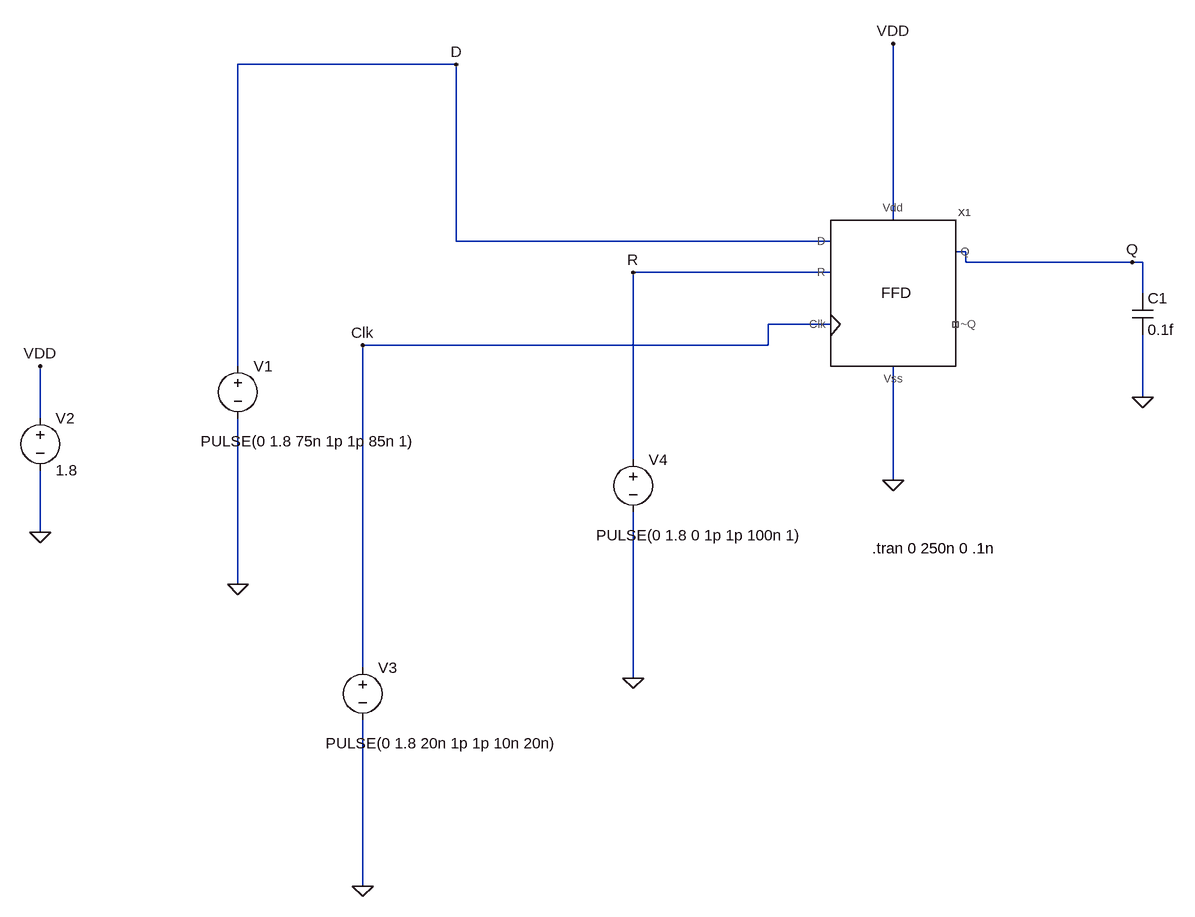
[diagram p0: schematic FFD_TB.asc]
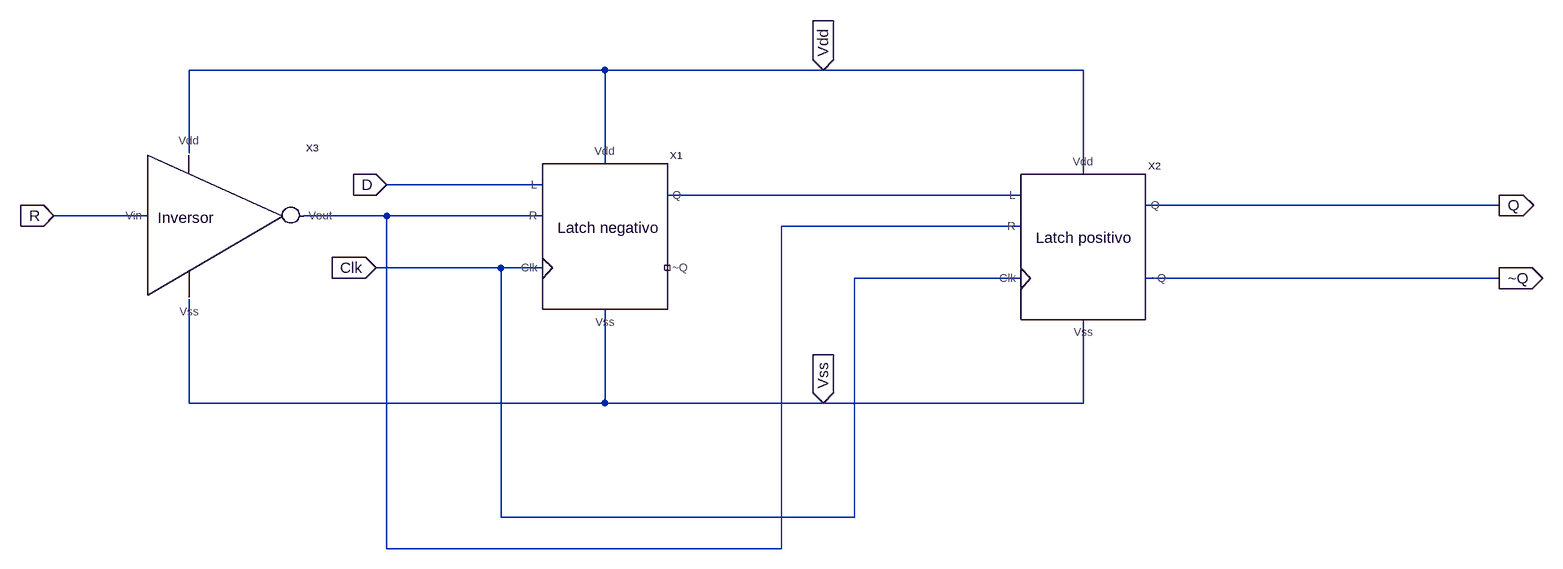
[diagram p1: sub-circuit ffd.asc]
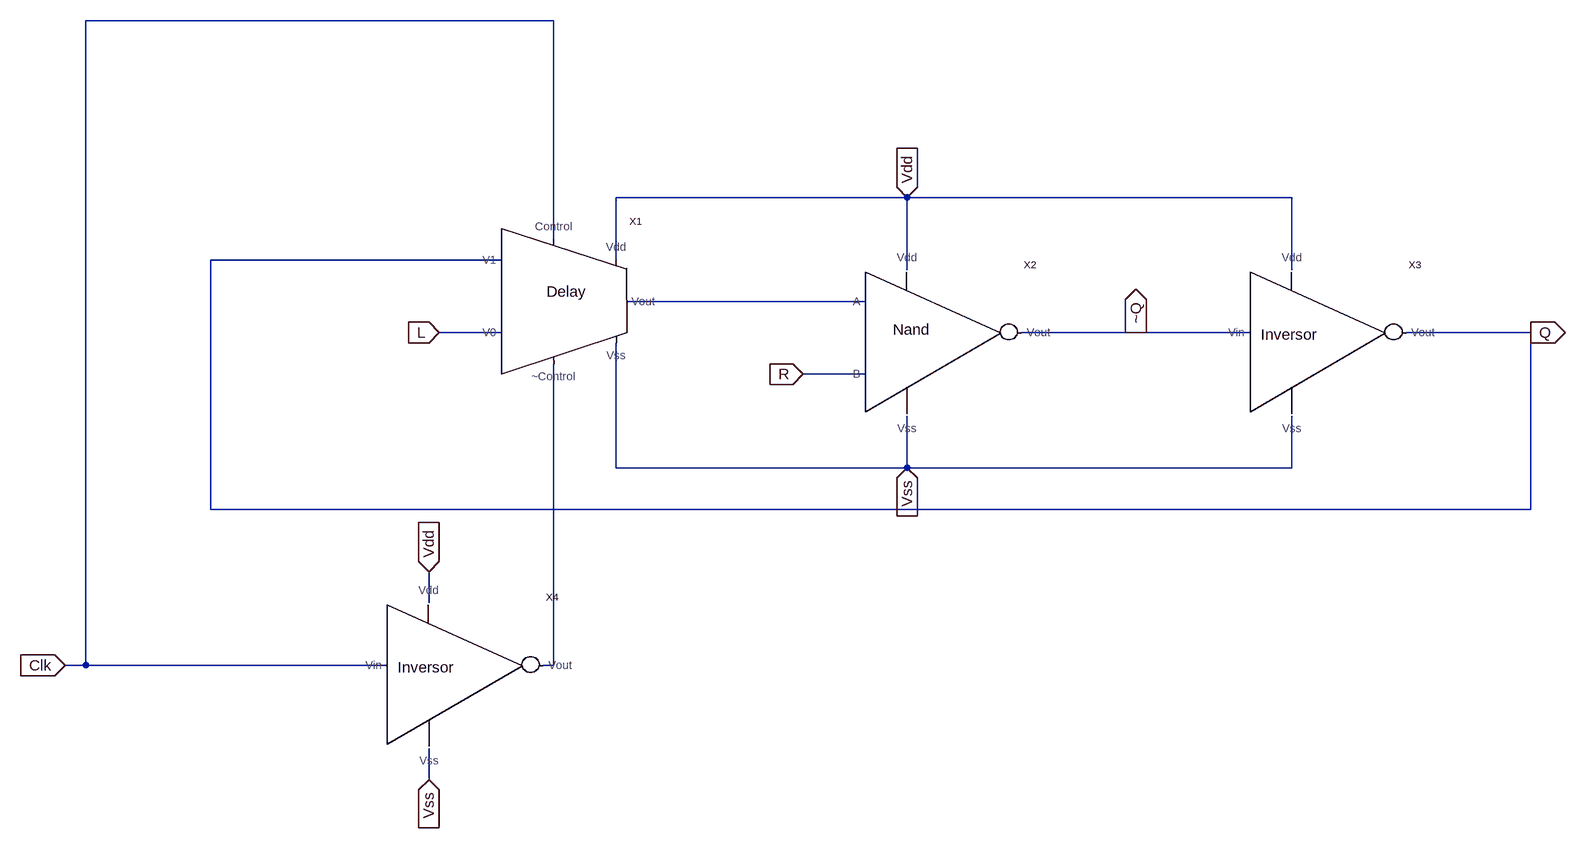
[diagram p2: sub-circuit latch_negativo.asc]
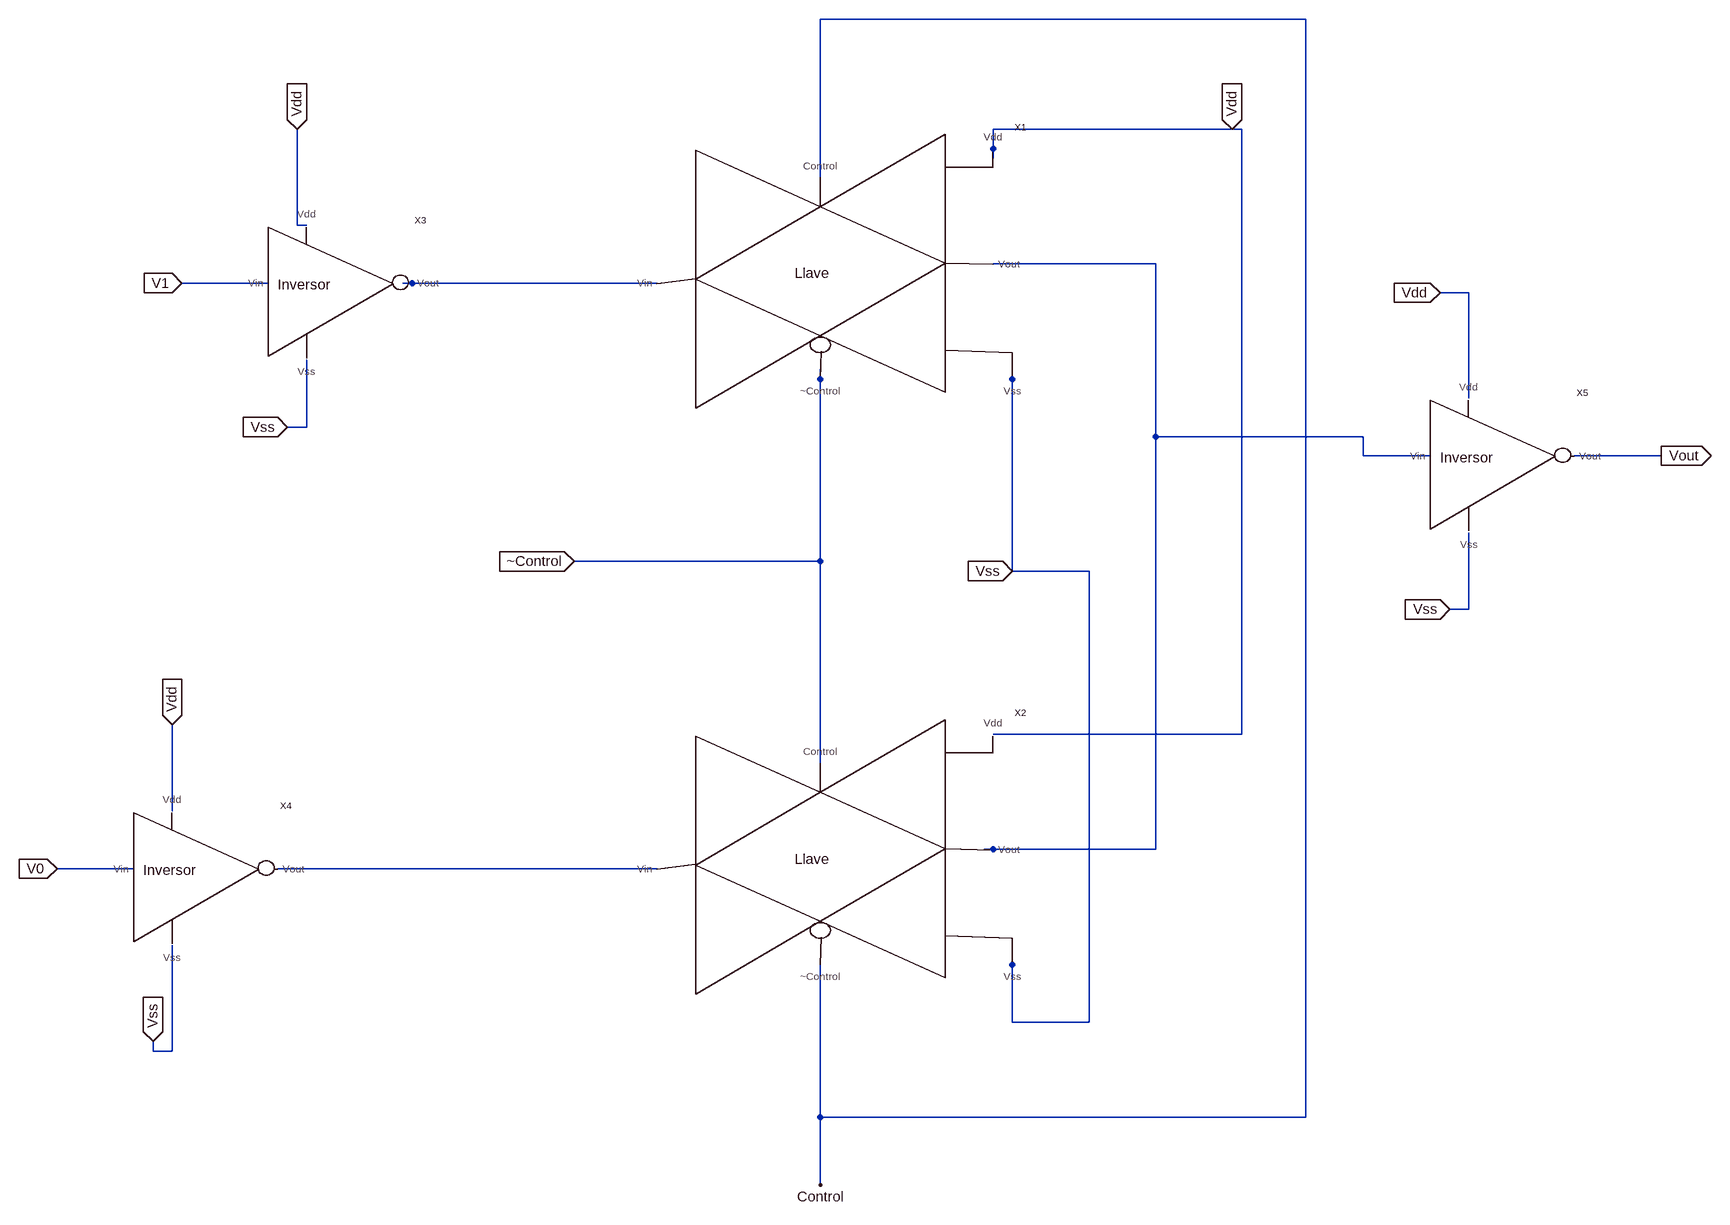
[diagram p3: sub-circuit mux.asc]
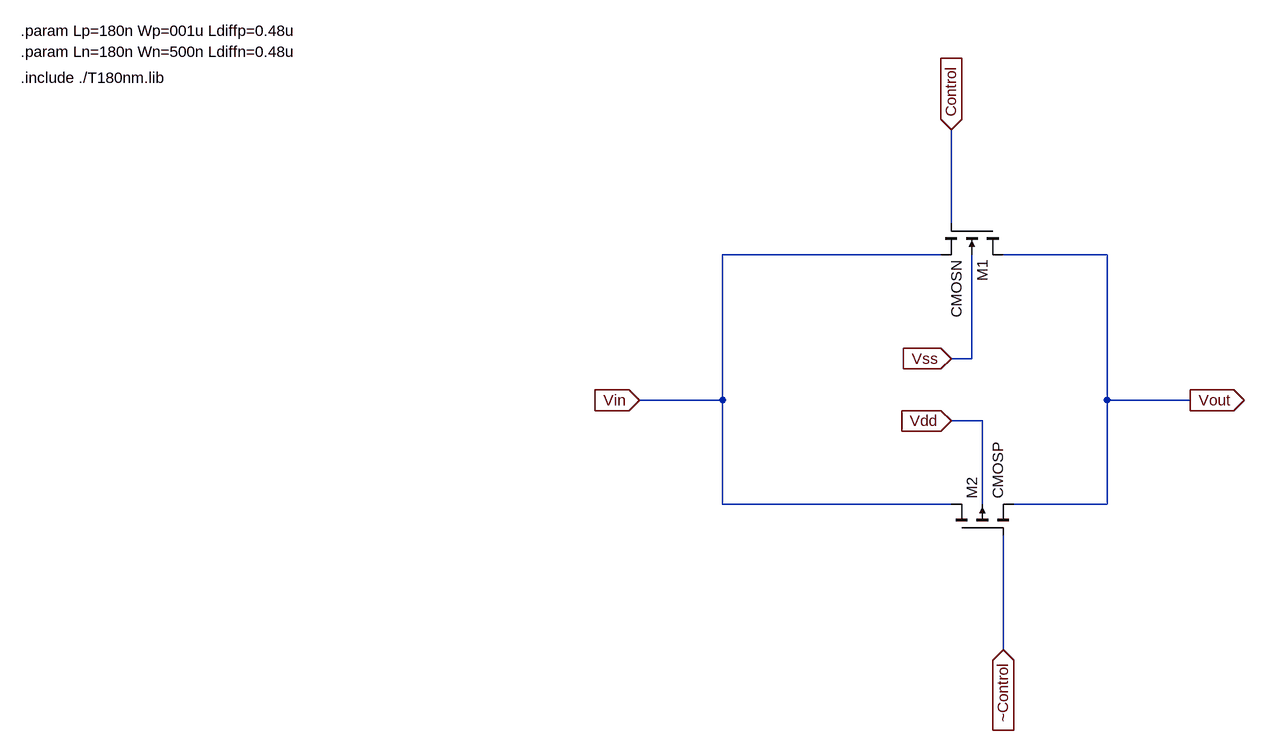
[diagram p4: sub-circuit transgate.asc]
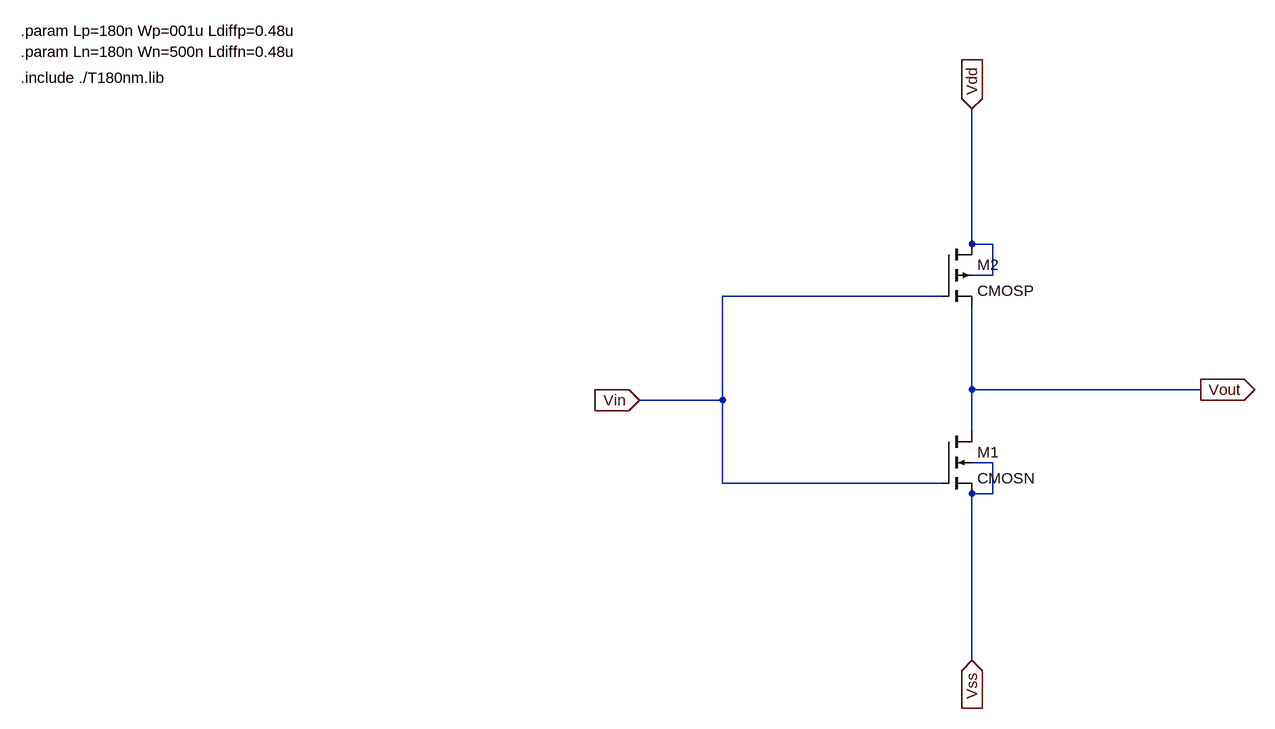
[diagram p5: sub-circuit inversor.asc]
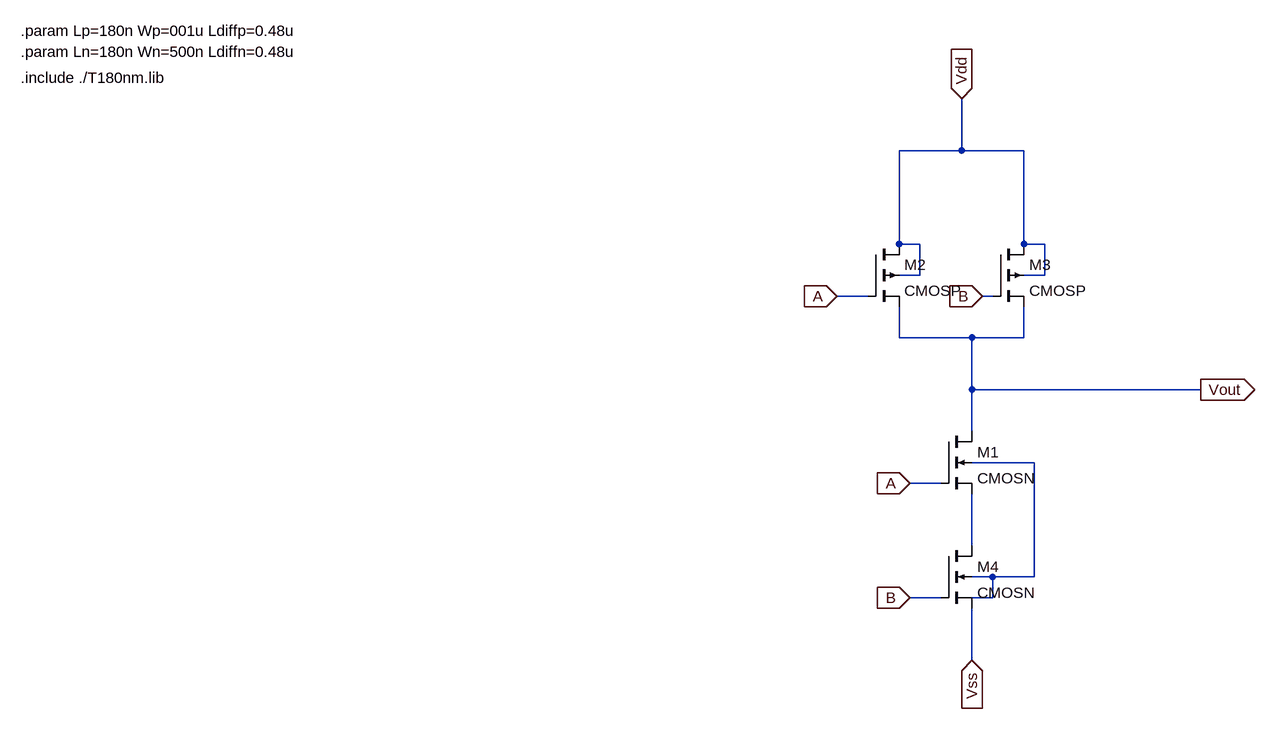
[diagram p6: sub-circuit nand.asc]
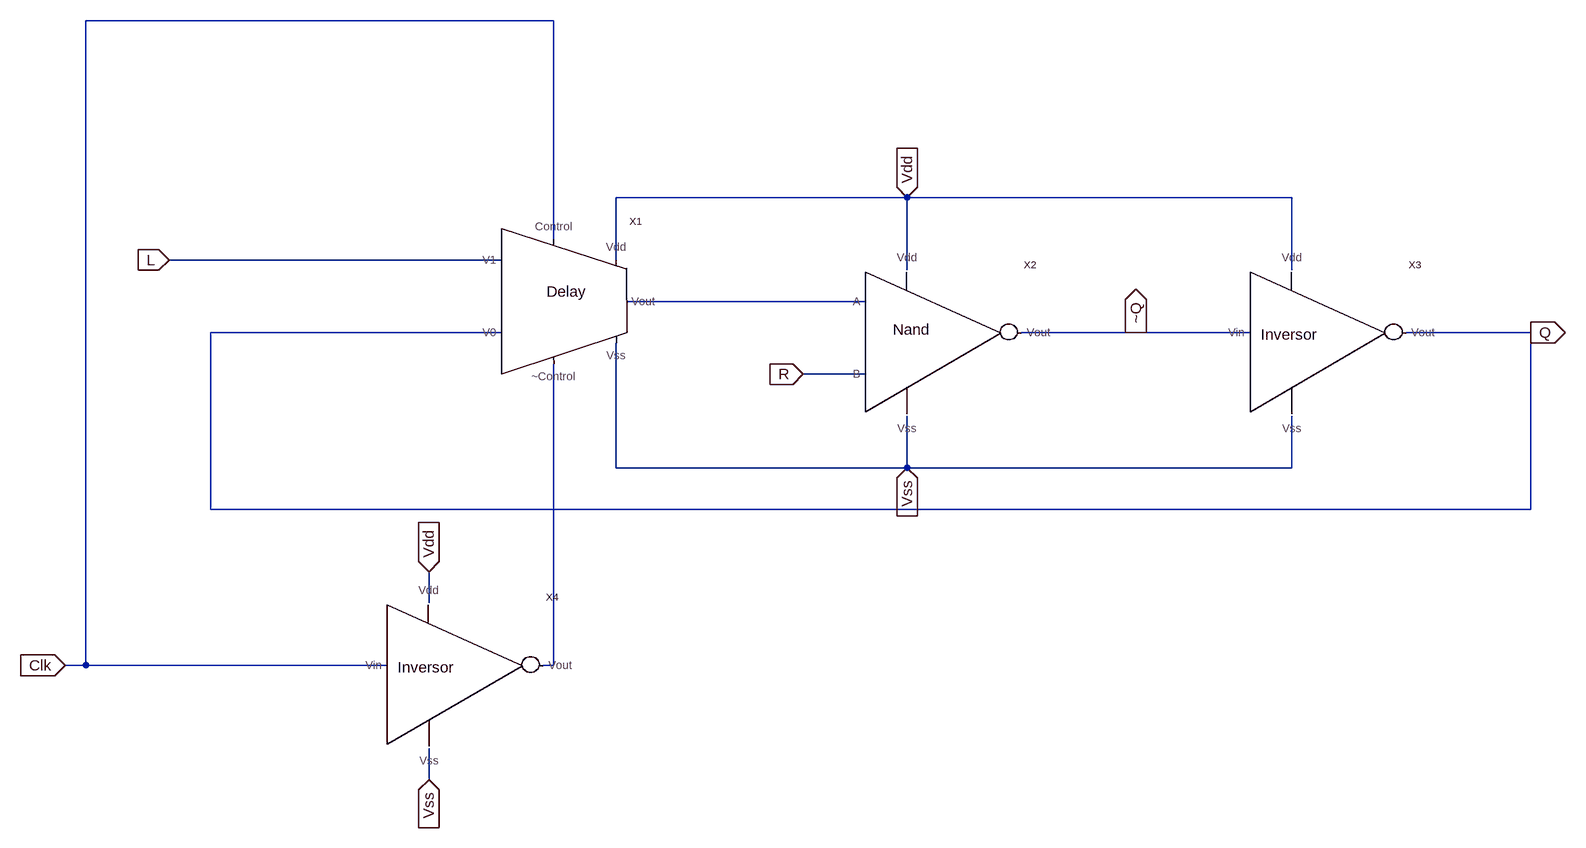
[diagram p7: sub-circuit latch_positivo.asc]
FFD_TB.asc, the LTspice schematic file:
Version 4
SHEET 1 1432 1476
WIRE -464 -208 -800 -208
WIRE 208 32 208 -240
WIRE -464 64 -464 -208
WIRE 112 64 -464 64
WIRE 320 80 304 80
WIRE 320 96 320 80
WIRE 576 96 320 96
WIRE 592 96 576 96
WIRE 112 112 -192 112
WIRE 592 144 592 96
WIRE 112 192 16 192
WIRE 16 224 16 192
WIRE 16 224 -608 224
WIRE -800 256 -800 -208
WIRE 592 304 592 208
WIRE -1104 336 -1104 256
WIRE -192 400 -192 112
WIRE 208 432 208 256
WIRE -1104 512 -1104 416
WIRE -800 592 -800 336
WIRE -608 720 -608 224
WIRE -192 736 -192 480
WIRE -608 1056 -608 800
FLAG 208 432 0
FLAG 208 -240 VDD
FLAG -1104 512 0
FLAG -800 592 0
FLAG -1104 256 VDD
FLAG 576 96 Q
FLAG 592 304 0
FLAG -608 1056 0
FLAG -608 224 Clk
FLAG -464 -208 D
FLAG -192 736 0
FLAG -192 112 R
SYMBOL voltage -800 240 R0
WINDOW 3 -57 132 Left 2
WINDOW 123 0 0 Left 2
WINDOW 39 0 0 Left 2
SYMATTR Value PULSE(0 1.8 75n 1p 1p 85n 1)
SYMATTR InstName V1
SYMBOL voltage -1104 320 R0
WINDOW 123 0 0 Left 2
WINDOW 39 0 0 Left 2
SYMATTR InstName V2
SYMATTR Value 1.8
SYMBOL cap 576 144 R0
SYMATTR InstName C1
SYMATTR Value 0.1f
SYMBOL voltage -608 704 R0
WINDOW 3 -57 132 Left 2
WINDOW 123 0 0 Left 2
WINDOW 39 0 0 Left 2
SYMATTR Value PULSE(0 1.8 20n 1p 1p 10n 20n)
SYMATTR InstName V3
SYMBOL voltage -192 384 R0
WINDOW 3 -57 132 Left 2
WINDOW 123 0 0 Left 2
WINDOW 39 0 0 Left 2
SYMATTR Value PULSE(0 1.8 0 1p 1p 100n 1)
SYMATTR InstName V4
SYMBOL FFD 208 144 R0
SYMATTR InstName X1
TEXT 176 536 Left 2 !.tran 0 250n 0 .1n

ffd.asc, the sub-circuit schematic file:
Version 4
SHEET 1 1432 1476
WIRE -288 -160 -928 -160
WIRE 48 -160 -288 -160
WIRE 448 -160 48 -160
WIRE -928 -32 -928 -160
WIRE -288 -16 -288 -160
WIRE 448 0 448 -160
WIRE -384 16 -624 16
WIRE 352 32 -192 32
WIRE 1088 48 544 48
WIRE -992 64 -1136 64
WIRE -624 64 -752 64
WIRE -384 64 -624 64
WIRE 352 80 -16 80
WIRE -448 144 -640 144
WIRE -384 144 -448 144
WIRE 352 160 96 160
WIRE 1088 160 544 160
WIRE -928 352 -928 192
WIRE -288 352 -288 208
WIRE -288 352 -928 352
WIRE 48 352 -288 352
WIRE 448 352 448 224
WIRE 448 352 48 352
WIRE -448 528 -448 144
WIRE 96 528 96 160
WIRE 96 528 -448 528
WIRE -624 576 -624 64
WIRE -16 576 -16 80
WIRE -16 576 -624 576
FLAG -624 16 D
IOPIN -624 16 In
FLAG -640 144 Clk
IOPIN -640 144 In
FLAG 48 -160 Vdd
IOPIN 48 -160 In
FLAG 48 352 Vss
IOPIN 48 352 In
FLAG 1088 160 ~Q
IOPIN 1088 160 Out
FLAG 1088 48 Q
IOPIN 1088 48 Out
FLAG -1136 64 R
IOPIN -1136 64 In
SYMBOL latch_negativo -288 96 R0
SYMATTR InstName X1
SYMBOL latch_positivo 448 112 R0
SYMATTR InstName X2
SYMBOL inversor -928 64 R0
SYMATTR InstName X3

latch_negativo.asc, the sub-circuit schematic file:
Version 4
SHEET 1 1432 1476
WIRE -256 -336 -976 -336
WIRE 288 -64 -160 -64
WIRE 880 -64 288 -64
WIRE -256 0 -256 -336
WIRE -336 32 -784 32
WIRE -160 32 -160 -64
WIRE 288 48 288 -64
WIRE 880 48 880 -64
WIRE 224 96 -144 96
WIRE -336 144 -432 144
WIRE 640 144 464 144
WIRE 816 144 640 144
WIRE 1248 144 1056 144
WIRE 224 208 128 208
WIRE -160 352 -160 160
WIRE 288 352 288 272
WIRE 288 352 -160 352
WIRE 880 352 880 272
WIRE 880 352 288 352
WIRE -784 416 -784 32
WIRE 1248 416 1248 144
WIRE 1248 416 -784 416
WIRE -448 560 -448 512
WIRE -976 656 -976 -336
WIRE -976 656 -1008 656
WIRE -512 656 -976 656
WIRE -256 656 -256 192
WIRE -256 656 -272 656
WIRE -448 832 -448 784
FLAG -432 144 L
IOPIN -432 144 In
FLAG 128 208 R
IOPIN 128 208 In
FLAG -1008 656 Clk
IOPIN -1008 656 In
FLAG 288 352 Vss
IOPIN 288 352 In
FLAG -448 512 Vdd
IOPIN -448 512 In
FLAG -448 832 Vss
IOPIN -448 832 In
FLAG 288 -64 Vdd
IOPIN 288 -64 In
FLAG 1248 144 Q
IOPIN 1248 144 Out
FLAG 640 144 ~Q
IOPIN 640 144 Out
SYMBOL mux -272 80 R0
SYMATTR InstName X1
SYMBOL nand 288 144 R0
SYMATTR InstName X2
SYMBOL inversor 880 144 R0
SYMATTR InstName X3
SYMBOL inversor -448 656 R0
SYMATTR InstName X4

mux.asc, the sub-circuit schematic file:
Version 4
SHEET 1 1664 1760
WIRE 944 -1056 -608 -1056
WIRE 608 -784 -320 -784
WIRE 624 -784 608 -784
WIRE -320 -752 -320 -784
WIRE -320 -736 -320 -752
WIRE -608 -704 -608 -1056
WIRE -1712 -624 -1712 -784
WIRE -1696 -624 -1712 -624
WIRE 384 -560 -320 -560
WIRE -1760 -528 -1904 -528
WIRE -1520 -528 -1536 -528
WIRE -880 -528 -1520 -528
WIRE 1216 -512 1168 -512
WIRE -608 -368 -608 -384
WIRE -288 -368 -288 -384
WIRE 1216 -336 1216 -512
WIRE -1696 -288 -1696 -400
WIRE -1696 -288 -1728 -288
WIRE 384 -272 384 -560
WIRE 1040 -272 384 -272
WIRE 1040 -240 1040 -272
WIRE 1152 -240 1040 -240
WIRE 1552 -240 1392 -240
WIRE -608 -64 -608 -368
WIRE -608 -64 -1072 -64
WIRE -288 -48 -288 -368
WIRE 128 -48 -288 -48
WIRE 1216 16 1216 -112
WIRE 1216 16 1184 16
WIRE 624 224 624 -784
WIRE 624 224 -320 224
WIRE -608 272 -608 -64
WIRE -1920 352 -1920 208
WIRE -320 416 -336 416
WIRE 384 416 384 -272
WIRE 384 416 -320 416
WIRE -1984 448 -2112 448
WIRE -880 448 -1744 448
WIRE -288 608 -288 592
WIRE -288 704 -288 608
WIRE 128 704 128 -48
WIRE 128 704 -288 704
WIRE -1952 752 -1952 736
WIRE -1920 752 -1920 576
WIRE -1920 752 -1952 752
WIRE -608 1344 -608 608
WIRE 944 1344 944 -1056
WIRE 944 1344 -608 1344
WIRE -608 1632 -608 1344
FLAG -1072 -64 ~Control
IOPIN -1072 -64 In
FLAG -288 -48 Vss
IOPIN -288 -48 In
FLAG 608 -784 Vdd
IOPIN 608 -784 In
FLAG -608 1632 Control
FLAG -1904 -528 V1
IOPIN -1904 -528 In
FLAG -2112 448 V0
IOPIN -2112 448 In
FLAG -1712 -784 Vdd
IOPIN -1712 -784 In
FLAG -1728 -288 Vss
IOPIN -1728 -288 In
FLAG -1920 208 Vdd
IOPIN -1920 208 In
FLAG -1952 736 Vss
IOPIN -1952 736 In
FLAG 1168 -512 Vdd
IOPIN 1168 -512 In
FLAG 1184 16 Vss
IOPIN 1184 16 In
FLAG 1552 -240 Vout
IOPIN 1552 -240 Out
SYMBOL transgate -624 -544 R0
SYMATTR InstName X1
SYMBOL transgate -624 432 R0
SYMATTR InstName X2
SYMBOL inversor -1696 -528 R0
SYMATTR InstName X3
SYMBOL inversor -1920 448 R0
SYMATTR InstName X4
SYMBOL inversor 1216 -240 R0
SYMATTR InstName X5

transgate.asc, the sub-circuit schematic file:
Version 4
SHEET 1 880 712
WIRE 192 -128 192 -272
WIRE 176 -80 -160 -80
WIRE 432 -80 272 -80
WIRE 224 80 224 -80
WIRE 224 80 192 80
WIRE -160 144 -160 -80
WIRE -160 144 -288 144
WIRE 432 144 432 -80
WIRE 560 144 432 144
WIRE 240 176 192 176
WIRE -160 304 -160 144
WIRE 192 304 -160 304
WIRE 240 304 240 176
WIRE 432 304 432 144
WIRE 432 304 288 304
WIRE 272 528 272 352
FLAG -288 144 Vin
IOPIN -288 144 In
FLAG 560 144 Vout
IOPIN 560 144 Out
FLAG 192 -272 Control
IOPIN 192 -272 In
FLAG 272 528 ~Control
IOPIN 272 528 In
FLAG 192 176 Vdd
IOPIN 192 176 In
FLAG 192 80 Vss
IOPIN 192 80 In
SYMBOL nmos4 272 -128 R90
SYMATTR InstName M1
SYMATTR Value CMOSN
SYMATTR Value2 l={Ln} w={Wn} ad={Ldiffn*Wn} as={Ldiffn*Wn} pd={2*Ldiffn+Wn} ps={2*Ldiffn+Wn}
SYMBOL pmos4 192 352 R270
SYMATTR InstName M2
SYMATTR Value CMOSP
SYMATTR Value2 l={Lp} w={Wp} ad={Ldiffp*Wp} as={Ldiffp*Wp} pd={2*Ldiffp+Wp} ps={2*Ldiffp+Wp}
TEXT -1240 -352 Left 2 !.include ./T180nm.lib
TEXT -1240 -424 Left 2 !.param Lp=180n Wp=001u Ldiffp=0.48u
TEXT -1240 -392 Left 2 !.param Ln=180n Wn=500n Ldiffn=0.48u

inversor.asc, the sub-circuit schematic file:
Version 4
SHEET 1 880 712
WIRE 224 -96 224 -304
WIRE 256 -96 224 -96
WIRE 256 -48 256 -96
WIRE 256 -48 224 -48
WIRE 176 -16 -160 -16
WIRE 224 128 224 0
WIRE 576 128 224 128
WIRE -160 144 -160 -16
WIRE -160 144 -288 144
WIRE 224 192 224 128
WIRE 256 240 224 240
WIRE -160 272 -160 144
WIRE 176 272 -160 272
WIRE 256 288 256 240
WIRE 256 288 224 288
WIRE 224 544 224 288
FLAG -288 144 Vin
IOPIN -288 144 In
FLAG 576 128 Vout
IOPIN 576 128 Out
FLAG 224 -304 Vdd
IOPIN 224 -304 In
FLAG 224 544 Vss
IOPIN 224 544 In
SYMBOL nmos4 176 192 R0
SYMATTR InstName M1
SYMATTR Value CMOSN
SYMATTR Value2 l={Ln} w={Wn} ad={Ldiffn*Wn} as={Ldiffn*Wn} pd={2*Ldiffn+Wn} ps={2*Ldiffn+Wn}
SYMBOL pmos4 176 -96 R0
SYMATTR InstName M2
SYMATTR Value CMOSP
SYMATTR Value2 l={Lp} w={Wp} ad={Ldiffp*Wp} as={Ldiffp*Wp} pd={2*Ldiffp+Wp} ps={2*Ldiffp+Wp}
TEXT -1240 -352 Left 2 !.include ./T180nm.lib
TEXT -1240 -424 Left 2 !.param Lp=180n Wp=001u Ldiffp=0.48u
TEXT -1240 -392 Left 2 !.param Ln=180n Wn=500n Ldiffn=0.48u

nand.asc, the sub-circuit schematic file:
Version 4
SHEET 1 880 712
WIRE 208 -240 208 -320
WIRE 208 -240 112 -240
WIRE 304 -240 208 -240
WIRE 112 -96 112 -240
WIRE 144 -96 112 -96
WIRE 304 -96 304 -240
WIRE 336 -96 304 -96
WIRE 304 -80 304 -96
WIRE 144 -48 144 -96
WIRE 144 -48 112 -48
WIRE 336 -48 336 -96
WIRE 336 -48 304 -48
WIRE 64 -16 16 -16
WIRE 256 -16 240 -16
WIRE 112 48 112 0
WIRE 224 48 112 48
WIRE 304 48 304 0
WIRE 304 48 224 48
WIRE 224 128 224 48
WIRE 576 128 224 128
WIRE 224 192 224 128
WIRE 320 240 224 240
WIRE 176 272 128 272
WIRE 224 368 224 288
WIRE 256 416 224 416
WIRE 320 416 320 240
WIRE 320 416 256 416
WIRE 176 448 128 448
WIRE 256 448 256 416
WIRE 256 448 224 448
WIRE 224 544 224 464
FLAG 576 128 Vout
IOPIN 576 128 Out
FLAG 208 -320 Vdd
IOPIN 208 -320 In
FLAG 224 544 Vss
IOPIN 224 544 In
FLAG 16 -16 A
IOPIN 16 -16 In
FLAG 128 272 A
IOPIN 128 272 In
FLAG 128 448 B
IOPIN 128 448 In
FLAG 240 -16 B
IOPIN 240 -16 In
SYMBOL nmos4 176 192 R0
SYMATTR InstName M1
SYMATTR Value CMOSN
SYMATTR Value2 l={Ln} w={Wn} ad={Ldiffn*Wn} as={Ldiffn*Wn} pd={2*Ldiffn+Wn} ps={2*Ldiffn+Wn}
SYMBOL pmos4 64 -96 R0
SYMATTR InstName M2
SYMATTR Value CMOSP
SYMATTR Value2 l={Lp} w={Wp} ad={Ldiffp*Wp} as={Ldiffp*Wp} pd={2*Ldiffp+Wp} ps={2*Ldiffp+Wp}
SYMBOL pmos4 256 -96 R0
SYMATTR InstName M3
SYMATTR Value CMOSP
SYMATTR Value2 l={Lp} w={Wp} ad={Ldiffp*Wp} as={Ldiffp*Wp} pd={2*Ldiffp+Wp} ps={2*Ldiffp+Wp}
SYMBOL nmos4 176 368 R0
SYMATTR InstName M4
SYMATTR Value CMOSN
SYMATTR Value2 l={Ln} w={Wn} ad={Ldiffn*Wn} as={Ldiffn*Wn} pd={2*Ldiffn+Wn} ps={2*Ldiffn+Wn}
TEXT -1240 -352 Left 2 !.include ./T180nm.lib
TEXT -1240 -424 Left 2 !.param Lp=180n Wp=001u Ldiffp=0.48u
TEXT -1240 -392 Left 2 !.param Ln=180n Wn=500n Ldiffn=0.48u

latch_positivo.asc, the sub-circuit schematic file:
Version 4
SHEET 1 1432 1476
WIRE -256 -336 -976 -336
WIRE 288 -64 -160 -64
WIRE 880 -64 288 -64
WIRE -256 0 -256 -336
WIRE -336 32 -848 32
WIRE -160 32 -160 -64
WIRE 288 48 288 -64
WIRE 880 48 880 -64
WIRE 224 96 -144 96
WIRE -336 144 -784 144
WIRE 640 144 464 144
WIRE 816 144 640 144
WIRE 1248 144 1056 144
WIRE 224 208 128 208
WIRE -160 352 -160 160
WIRE 288 352 288 272
WIRE 288 352 -160 352
WIRE 880 352 880 272
WIRE 880 352 288 352
WIRE -784 416 -784 144
WIRE 1248 416 1248 144
WIRE 1248 416 -784 416
WIRE -448 560 -448 512
WIRE -976 656 -976 -336
WIRE -976 656 -1008 656
WIRE -512 656 -976 656
WIRE -256 656 -256 192
WIRE -256 656 -272 656
WIRE -448 832 -448 784
FLAG -848 32 L
IOPIN -848 32 In
FLAG 128 208 R
IOPIN 128 208 In
FLAG -1008 656 Clk
IOPIN -1008 656 In
FLAG 288 352 Vss
IOPIN 288 352 In
FLAG -448 512 Vdd
IOPIN -448 512 In
FLAG -448 832 Vss
IOPIN -448 832 In
FLAG 288 -64 Vdd
IOPIN 288 -64 In
FLAG 1248 144 Q
IOPIN 1248 144 Out
FLAG 640 144 ~Q
IOPIN 640 144 Out
SYMBOL mux -272 80 R0
SYMATTR InstName X1
SYMBOL nand 288 144 R0
SYMATTR InstName X2
SYMBOL inversor 880 144 R0
SYMATTR InstName X3
SYMBOL inversor -448 656 R0
SYMATTR InstName X4

The netlist it stands for:
* FFD_TB.asc
V1 D 0 PULSE(0 1.8 75n 1p 1p 85n 1)
V2 VDD 0 1.8
C1 Q 0 0.1f
V3 Clk 0 PULSE(0 1.8 20n 1p 1p 10n 20n)
V4 R 0 PULSE(0 1.8 0 1p 1p 100n 1)
XX1 D VDD 0 Q Clk NC_01 R ffd

* block symbol definitions
.subckt ffd D Vdd Vss Q Clk ~Q R
XX1 D Vdd Vss N001 Clk NC_01 N002 latch_negativo
XX2 N001 Vdd Vss Q Clk ~Q N002 latch_positivo
XX3 R Vdd Vss N002 inversor
.ends ffd

.subckt latch_negativo L Vdd Vss Q Clk ~Q R
XX1 Q Vdd Vss N001 L Clk N002 mux
XX2 N001 Vdd Vss ~Q R nand
XX3 ~Q Vdd Vss Q inversor
XX4 Clk Vdd Vss N002 inversor
.ends latch_negativo

.subckt mux V1 Vdd Vss Vout V0 Control ~Control
XX1 N002 Vdd Vss N001 Control ~Control transgate
XX2 N003 Vdd Vss N001 ~Control Control transgate
XX3 V1 Vdd Vss N002 inversor
XX4 V0 Vdd Vss N003 inversor
XX5 N001 Vdd Vss Vout inversor
.ends mux

.subckt transgate Vin Vdd Vss Vout Control ~Control
M1 Vout Control Vin Vss CMOSN l={Ln} w={Wn} ad={Ldiffn*Wn} as={Ldiffn*Wn} pd={2*Ldiffn+Wn} ps={2*Ldiffn+Wn}
M2 Vin ~Control Vout Vdd CMOSP l={Lp} w={Wp} ad={Ldiffp*Wp} as={Ldiffp*Wp} pd={2*Ldiffp+Wp} ps={2*Ldiffp+Wp}
.include ./T180nm.lib
.param Lp=180n Wp=001u Ldiffp=0.48u
.param Ln=180n Wn=500n Ldiffn=0.48u
.ends transgate

.subckt inversor Vin Vdd Vss Vout
M1 Vout Vin Vss Vss CMOSN l={Ln} w={Wn} ad={Ldiffn*Wn} as={Ldiffn*Wn} pd={2*Ldiffn+Wn} ps={2*Ldiffn+Wn}
M2 Vdd Vin Vout Vdd CMOSP l={Lp} w={Wp} ad={Ldiffp*Wp} as={Ldiffp*Wp} pd={2*Ldiffp+Wp} ps={2*Ldiffp+Wp}
.include ./T180nm.lib
.param Lp=180n Wp=001u Ldiffp=0.48u
.param Ln=180n Wn=500n Ldiffn=0.48u
.ends inversor

.subckt nand A Vdd Vss Vout B
M1 Vout A N002 N001 CMOSN l={Ln} w={Wn} ad={Ldiffn*Wn} as={Ldiffn*Wn} pd={2*Ldiffn+Wn} ps={2*Ldiffn+Wn}
M2 Vdd A Vout Vdd CMOSP l={Lp} w={Wp} ad={Ldiffp*Wp} as={Ldiffp*Wp} pd={2*Ldiffp+Wp} ps={2*Ldiffp+Wp}
M3 Vdd B Vout Vdd CMOSP l={Lp} w={Wp} ad={Ldiffp*Wp} as={Ldiffp*Wp} pd={2*Ldiffp+Wp} ps={2*Ldiffp+Wp}
M4 N002 B Vss N001 CMOSN l={Ln} w={Wn} ad={Ldiffn*Wn} as={Ldiffn*Wn} pd={2*Ldiffn+Wn} ps={2*Ldiffn+Wn}
.include ./T180nm.lib
.param Lp=180n Wp=001u Ldiffp=0.48u
.param Ln=180n Wn=500n Ldiffn=0.48u
.ends nand

.subckt latch_positivo L Vdd Vss Q Clk ~Q R
XX1 L Vdd Vss N001 Q Clk N002 mux
XX2 N001 Vdd Vss ~Q R nand
XX3 ~Q Vdd Vss Q inversor
XX4 Clk Vdd Vss N002 inversor
.ends latch_positivo

.model NMOS NMOS
.model PMOS PMOS
.lib standard.mos
.tran 0 250n 0 .1n
.backanno
.end